# Altium schematic sheet 001_MCU.SchDoc
size A4; Organization: OLTEST; Revision: 01; SheetNumber: 1; SheetTotal: 12; Название листа: Название листа; Разработчик: Бондарчук С.; Прибор: R100; АМАК.000000.000 Э3: R100.220.040.000 Э3; Дата: 03.01.2018; Формат: A4
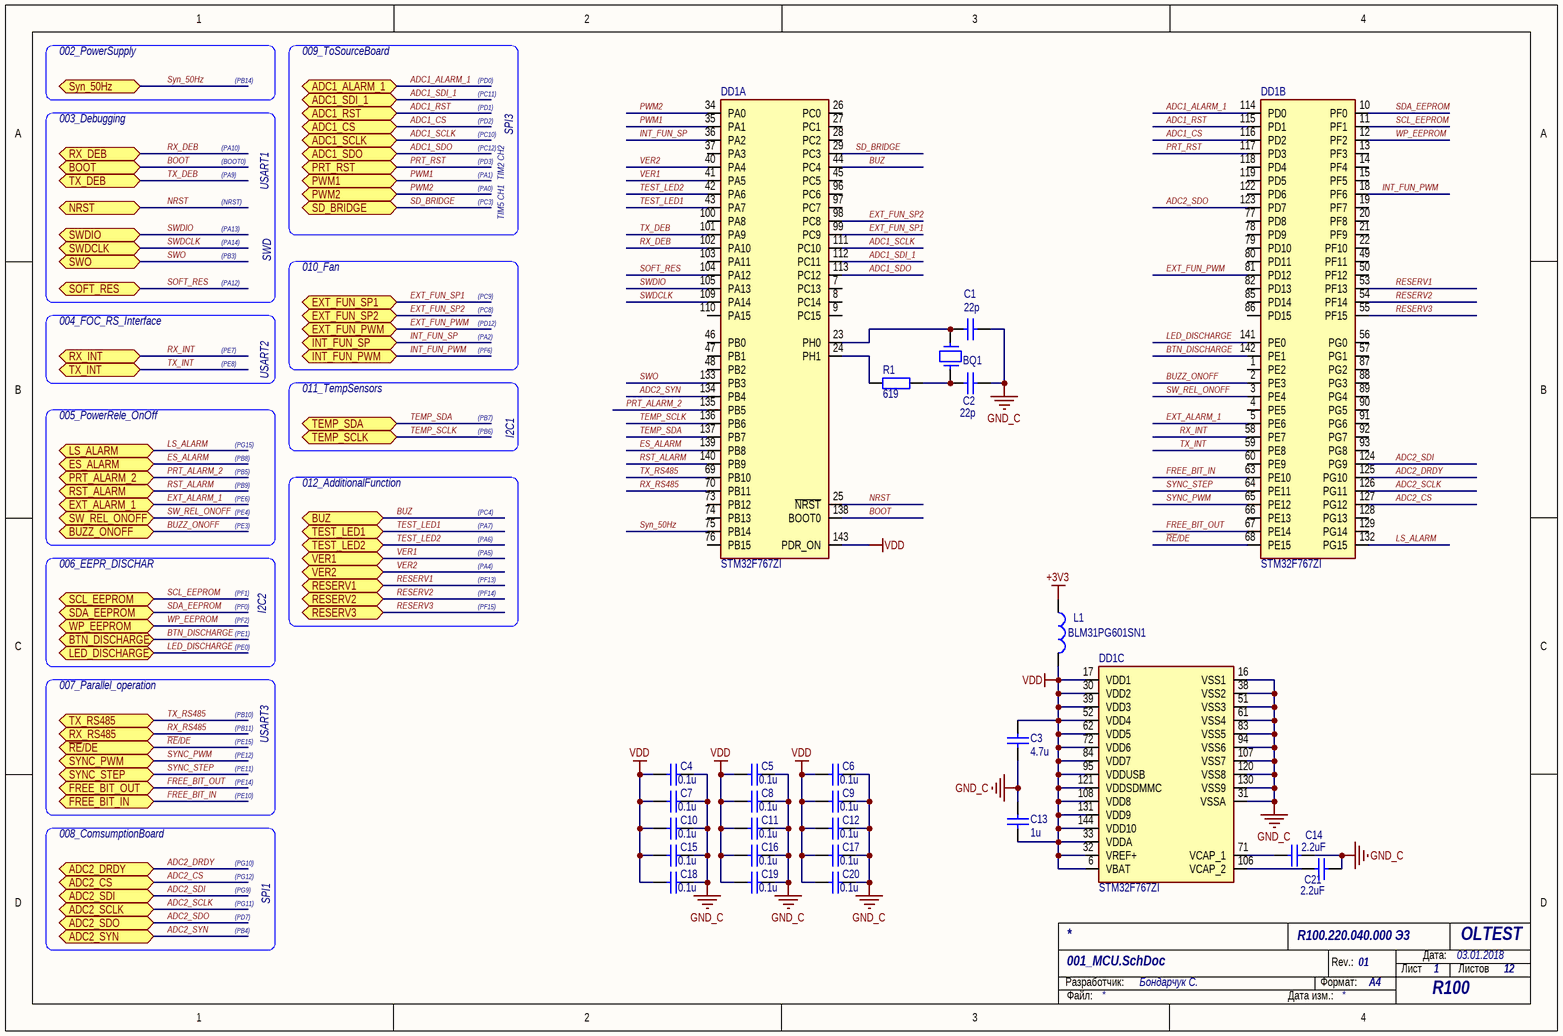
[diagram p0: 001_MCU.SchDoc]

## Parts
BQ1  12MHz  [DFN390P500X135-2N]  (value not drawn)
C1  22р  [SMD_C_0603]
C2  22р  [SMD_C_0603]
C3  4.7u  [SMD_C_0805]
C4  0.1u  [SMD_C_0603]
C5  0.1u  [SMD_C_0603]
C6  0.1u  [SMD_C_0603]
C7  0.1u  [SMD_C_0603]
C8  0.1u  [SMD_C_0603]
C9  0.1u  [SMD_C_0603]
C10  0.1u  [SMD_C_0603]
C11  0.1u  [SMD_C_0603]
C12  0.1u  [SMD_C_0603]
C13  1u  [SMD_C_0603]
C14  2.2uF  [SMD_C_0805]
C15  0.1u  [SMD_C_0603]
C16  0.1u  [SMD_C_0603]
C17  0.1u  [SMD_C_0603]
C18  0.1u  [SMD_C_0603]
C19  0.1u  [SMD_C_0603]
C20  0.1u  [SMD_C_0603]
C21  2.2uF  [SMD_C_0805]
DD1  STM32F767ZI  [SOT486-1_V]  (parts A,B,C of 3)
L1  BLM31PG601SN1  [SMD_L_1206]
R1  619  [SMD_R_0603]

## Ports
ADC1_ALARM_1, ADC1_CS, ADC1_RST, ADC1_SCLK, ADC1_SDI_1, ADC1_SDO, ADC2_CS, ADC2_DRDY, ADC2_SCLK, ADC2_SDI, ADC2_SDO, ADC2_SYN, BOOT, BTN_DISCHARGE, BUZ, BUZZ_ONOFF, ES_ALARM, EXT_ALARM_1, EXT_FUN_PWM, EXT_FUN_SP1, EXT_FUN_SP2, FREE_BIT_IN, FREE_BIT_OUT, INT_FUN_PWM, INT_FUN_SP, LED_DISCHARGE, LS_ALARM, NRST, PRT_ALARM_2, PRT_RST, PWM1, PWM2, RESERV1, RESERV2, RESERV3, RST_ALARM, RX_DEB, RX_INT, RX_RS485, SCL_EEPROM, SD_BRIDGE, SDA_EEPROM, SOFT_RES, SW_REL_ONOFF, SWDCLK, SWDIO, SWO, Syn_50Hz, SYNC_PWM, SYNC_STEP, TEMP_SCLK, TEMP_SDA, TEST_LED1, TEST_LED2, TX_DEB, TX_INT, TX_RS485, VER1, VER2, WP_EEPROM, ~{RE}/DE

## Nets
+3V3: L1.1
GND_C: C1.2 C2.2 C3.1 C4.2 C5.2 C6.2 C7.2 C8.2 C9.2 C10.2 C11.2 C12.2 C13.2 C14.2 C15.2 C16.2 C17.2 C18.2 C19.2 C20.2 C21.2 DD1.16(VSS1) DD1.31(VSSA) DD1.38(VSS2) DD1.51(VSS3) DD1.61(VSS4) DD1.83(VSS5) DD1.94(VSS6) DD1.107(VSS7) DD1.120(VSS8) DD1.130(VSS9)
VDD: C3.2 C4.1 C5.1 C6.1 C7.1 C8.1 C9.1 C10.1 C11.1 C12.1 C13.1 C15.1 C16.1 C17.1 C18.1 C19.1 C20.1 DD1.6(VBAT) DD1.17(VDD1) DD1.30(VDD2) DD1.32(VREF+) DD1.33(VDDA) DD1.39(VDD3) DD1.52(VDD4) DD1.62(VDD5) DD1.72(VDD6) DD1.84(VDD7) DD1.95(VDDUSB) DD1.108(VDD8) DD1.121(VDDSDMMC) DD1.131(VDD9) DD1.143(PDR_ON) DD1.144(VDD10) L1.2
~{RE}/DE: DD1.68(PE15) ; port ~{RE}/DE
ADC1_ALARM_1: DD1.114(PD0) ; port ADC1_ALARM_1
ADC1_CS: DD1.116(PD2) ; port ADC1_CS
ADC1_RST: DD1.115(PD1) ; port ADC1_RST
ADC1_SCLK: DD1.111(PC10) ; port ADC1_SCLK
ADC1_SDI_1: DD1.112(PC11) ; port ADC1_SDI_1
ADC1_SDO: DD1.113(PC12) ; port ADC1_SDO
ADC2_CS: DD1.127(PG12) ; port ADC2_CS
ADC2_DRDY: DD1.125(PG10) ; port ADC2_DRDY
ADC2_SCLK: DD1.126(PG11) ; port ADC2_SCLK
ADC2_SDI: DD1.124(PG9) ; port ADC2_SDI
ADC2_SDO: DD1.123(PD7) ; port ADC2_SDO
ADC2_SYN: DD1.134(PB4) ; port ADC2_SYN
BOOT: DD1.138(BOOT0) ; port BOOT
BTN_DISCHARGE: DD1.142(PE1) ; port BTN_DISCHARGE
BUZ: DD1.44(PC4) ; port BUZ
BUZZ_ONOFF: DD1.2(PE3) ; port BUZZ_ONOFF
ES_ALARM: DD1.139(PB8) ; port ES_ALARM
EXT_ALARM_1: DD1.5(PE6) ; port EXT_ALARM_1
EXT_FUN_PWM: DD1.81(PD12) ; port EXT_FUN_PWM
EXT_FUN_SP1: DD1.99(PC9) ; port EXT_FUN_SP1
EXT_FUN_SP2: DD1.98(PC8) ; port EXT_FUN_SP2
FREE_BIT_IN: DD1.63(PE10) ; port FREE_BIT_IN
FREE_BIT_OUT: DD1.67(PE14) ; port FREE_BIT_OUT
INT_FUN_PWM: DD1.18(PF6) ; port INT_FUN_PWM
INT_FUN_SP: DD1.36(PA2) ; port INT_FUN_SP
LED_DISCHARGE: DD1.141(PE0) ; port LED_DISCHARGE
LS_ALARM: DD1.132(PG15) ; port LS_ALARM
NRST: DD1.25(~{NRST}) ; port NRST
PRT_ALARM_2: DD1.135(PB5) ; port PRT_ALARM_2
PRT_RST: DD1.117(PD3) ; port PRT_RST
PWM1: DD1.35(PA1) ; port PWM1
PWM2: DD1.34(PA0) ; port PWM2
RESERV1: DD1.53(PF13) ; port RESERV1
RESERV2: DD1.54(PF14) ; port RESERV2
RESERV3: DD1.55(PF15) ; port RESERV3
RST_ALARM: DD1.140(PB9) ; port RST_ALARM
RX_DEB: DD1.102(PA10) ; port RX_DEB
RX_INT: DD1.58(PE7) ; port RX_INT
RX_RS485: DD1.70(PB11) ; port RX_RS485
SCL_EEPROM: DD1.11(PF1) ; port SCL_EEPROM
SD_BRIDGE: DD1.29(PC3) ; port SD_BRIDGE
SDA_EEPROM: DD1.10(PF0) ; port SDA_EEPROM
SOFT_RES: DD1.104(PA12) ; port SOFT_RES
SW_REL_ONOFF: DD1.3(PE4) ; port SW_REL_ONOFF
SWDCLK: DD1.109(PA14) ; port SWDCLK
SWDIO: DD1.105(PA13) ; port SWDIO
SWO: DD1.133(PB3) ; port SWO
Syn_50Hz: DD1.75(PB14) ; port Syn_50Hz
SYNC_PWM: DD1.65(PE12) ; port SYNC_PWM
SYNC_STEP: DD1.64(PE11) ; port SYNC_STEP
TEMP_SCLK: DD1.136(PB6) ; port TEMP_SCLK
TEMP_SDA: DD1.137(PB7) ; port TEMP_SDA
TEST_LED1: DD1.43(PA7) ; port TEST_LED1
TEST_LED2: DD1.42(PA6) ; port TEST_LED2
TX_DEB: DD1.101(PA9) ; port TX_DEB
TX_INT: DD1.59(PE8) ; port TX_INT
TX_RS485: DD1.69(PB10) ; port TX_RS485
VER1: DD1.41(PA5) ; port VER1
VER2: DD1.40(PA4) ; port VER2
WP_EEPROM: DD1.12(PF2) ; port WP_EEPROM
NetBQ1_1: BQ1.1 C2.1 R1.2
NetBQ1_2: BQ1.2 C1.1 DD1.23(PH0)
NetC14_1: C14.1 DD1.71(VCAP_1)
NetC21_1: C21.1 DD1.106(VCAP_2)
NetDD1_24: DD1.24(PH1) R1.1

Not connected (* = marked no-connect by the designer): DD1 1(PE2) 4(PE5) 7(PC13) 8(PC14) 9(PC15) 13(PF3) 14(PF4) 15(PF5) 19(PF7) 20(PF8) 21(PF9) 22(PF10) 26(PC0) 27(PC1) 28(PC2) 37(PA3) 45(PC5) 46(PB0) 47(PB1) 48(PB2) 49(PF11) 50(PF12) 56(PG0) 57(PG1) 60(PE9) 66(PE13) 73(PB12) 74(PB13) 76(PB15) 77(PD8) 78(PD9) 79(PD10) 80(PD11) 82(PD13) 85(PD14) 86(PD15) 87(PG2) 88(PG3) 89(PG4) 90(PG5) 91(PG6) 92(PG7) 93(PG8) 96(PC6) 97(PC7) 100(PA8) 103(PA11) 110(PA15) 118(PD4) 119(PD5) 122(PD6) 128(PG13) 129(PG14)

## Notes on the sheet
- 002_PowerSupply
- (PB14)
- 009_ToSourceBoard
- (PC11)
- (PD0)
- (PD1)
- 003_Debugging
- (PA10)
- (BOOT0)
- (PA9)
- (PC10)
- (PC12)
- (PA1)
- (PD2)
- (PD3)
- TIM2 CH2
- SPI3
- (NRST)
- (PA13)
- (PA14)
- USART1
- (PA0)
- (PС3)
- TIM5 CH1
- (PB3)
- (PA12)
- SWD
- 010_Fan
- (PC9)
- (PC8)
- 004_FOC_RS_Interface
- (PE8)
- (PE7)
- USART2
- (PA2)
- (PD12)
- (PF6)
- 005_PowerRele_OnOff
- (PG15)
- 011_TempSensors
- (PB7)
- (PB6)
- I2C1
- (PB8)
- (PB5)
- (PE6)
- (PB9)
- (PE4)
- 012_AdditionalFunction
- (PC4)
- 006_EEPR_DISCHAR
- (PE3)
- (PA7)
- (PA6)
- (PA5)
- (PA4)
- (PF13)
- (PF1)
- (PF0)
- (PF2)
- (PE1)
- (PE0)
- I2C2
- (PF14)
- (PF15)
- 007_Parallel_operation
- (PB10)
- (PB11)
- (PE15)
- (PE14)
- (PE12)
- (PE11)
- USART3
- 008_ComsumptionBoard
- (PE10)
- (PG9)
- (PG11)
- (PD7)
- (PG10)
- (PG12)
- SPI1
- (PB4)
- Разработчик:
- Формат:
- Rev.:
- Лист
- Дата:
- Листов
- Файл:
- Дата изм.:

## Library data of the parts
BQ1 = 7A-12.000MAAJ-T: 12MHz Quartz Crystal 7A; Manufacturer: TXC; PartNumber: 7A-12.000MAAJ-T; Value: 12MHz
C1 C2 = C0603 22p 50V 5%: SMD C 0603 MURATA 50V 5% C0G; PartNumber: GRM1885C1H220JA01; Manufacturer: MURATA; Value: 22р
C3 = C0805 4.7u 25V 20%  X5R: SMD C 0805 MURATA 50V 5% NP0; PartNumber: GRM21BR61E475M; Manufacturer: MURATA; Value: 4.7u
C4-C12 C15-C20 = C0603 0.1u 50V 10%: SMD C 0603 MURATA 50V 10% X7R; PartNumber: GRM188R71H104K; Manufacturer: MURATA; Value: 0.1u
C13 = C0603 1uF 25V 10%: SMD C 0603 MURATA 25V 10% X7R; PartNumber: GRM188R71E105KA12; Manufacturer: MURATA; Value: 1u
C14 C21 = C0805 2.2u 25V 10% X7R: SMD C 0805 MURATA 25V 10% X7R; PartNumber: GRM21BR61H225M; Manufacturer: MURATA; Value: 2.2uF
DD1 = STM32F767ZI: 32-bit ARM Cortex-M7 MCU+FPU; Manufactorer: ST; PartNumber: STM32F767ZI
L1 = BLM31PG601SN1: 600R 1.5A (100MHz); Manufacturer: TDK; Value: 600R 1.5A (100MHz); PartNumber: BLM31PG601SN1
R1 = R0603 619 1%: SMD 0603 VISHAY 0.1W 75V 1% 100ppm; PartNumber: CRCW0603619RFK; Manufacturer: VISHAY; Value: 619